# Altium schematic sheet game_console_schematic.SchDoc
size A4; SheetNumber: 1; SheetTotal: 2
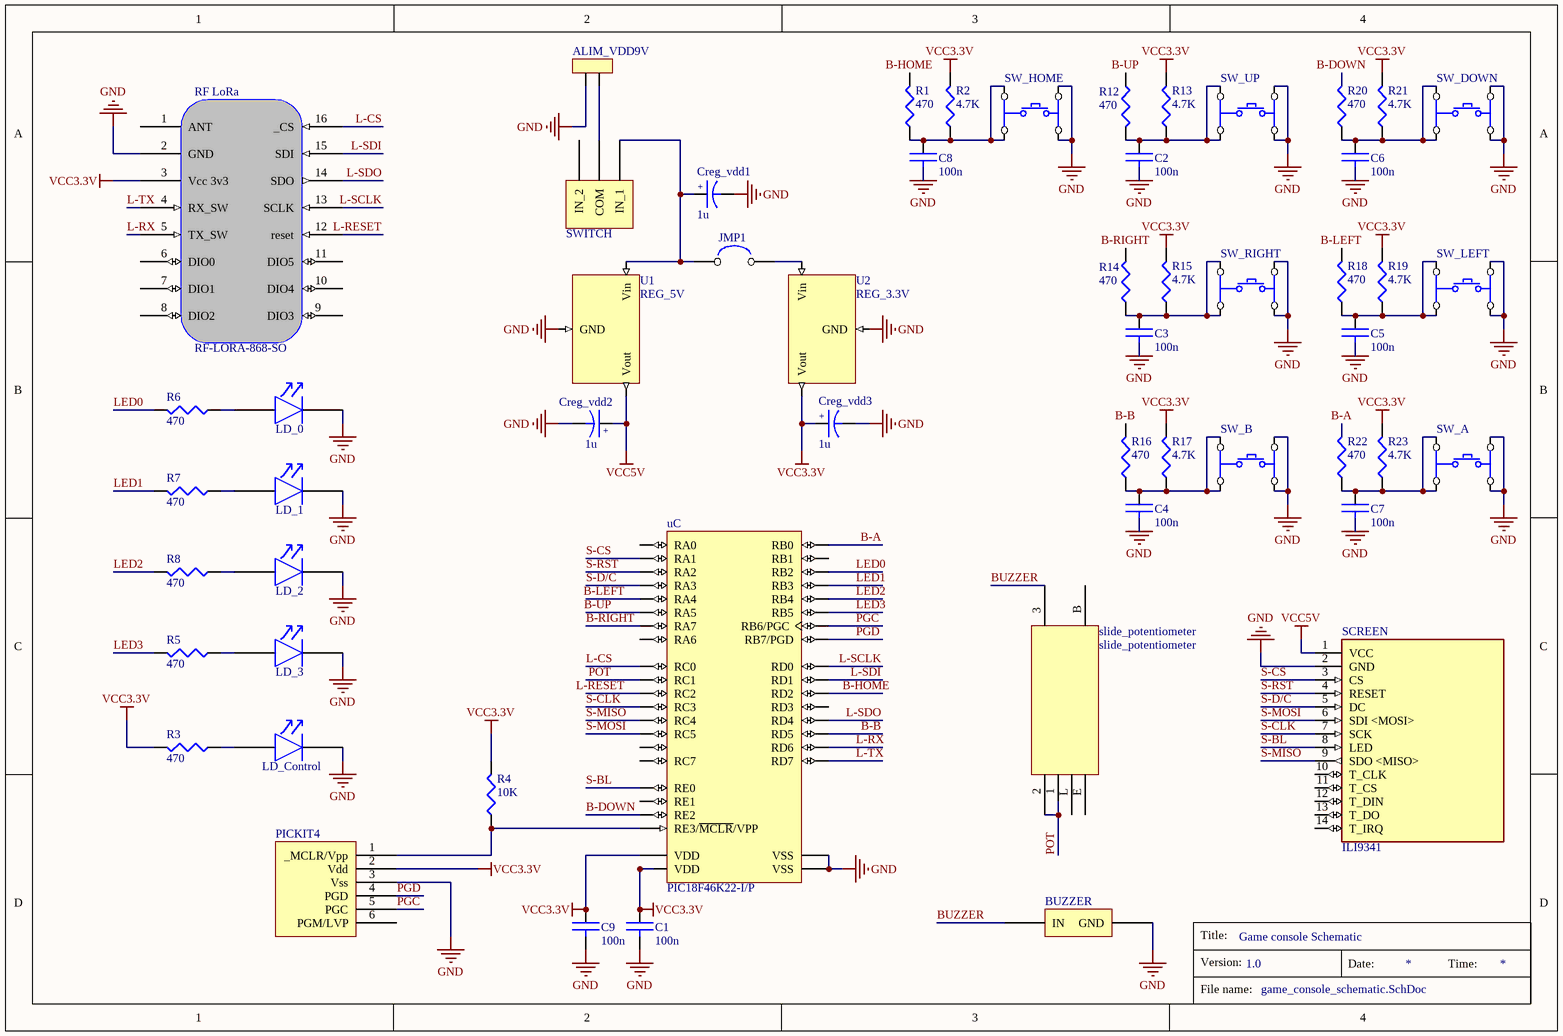
[diagram p0: game_console_schematic.SchDoc]

## Parts
ALIM_VDD9V  ALIM_9V  [AMP_2]  (value not drawn)
BUZZER  BUZZER  [BUZZER]  (value not drawn)
C1  value 100n  [0805]  (hidden comment: CAP)
C2  value 100n  [0805]  (hidden comment: C)
C3  value 100n  [0805]  (hidden comment: C)
C4  value 100n  [0805]  (hidden comment: C)
C5  value 100n  [0805]  (hidden comment: C)
C6  value 100n  [0805]  (hidden comment: C)
C7  value 100n  [0805]  (hidden comment: C)
C8  value 100n  [0805]  (hidden comment: C)
C9  value 100n  [0805]  (hidden comment: CAP)
Creg_vdd1  value 1u  [RB.2/.4]  (hidden comment: CAP_POL)
Creg_vdd2  value 1u  [RB.2/.4]  (hidden comment: CAP_POL)
Creg_vdd3  value 1u  [RB.2/.4]  (hidden comment: CAP_POL)
JMP1  JUMPER  [JMP2-100]  (value not drawn)
LD_0  0  [LED0805]  (value not drawn)
LD_1  1  [LED0805]  (value not drawn)
LD_2  2  [LED0805]  (value not drawn)
LD_3  3  [LED0805]  (value not drawn)
LD_Control  comment  [LED0805]  (value not drawn)
PICKIT4  PIC-ICSP  [PIC-ICSP]  (value not drawn)
R1  value 470  [0805]  (hidden comment: R0)
R2  value 4.7K  [0805]  (hidden comment: RK)
R3  value 470  [0805]  (hidden comment: R0)
R4  value 10K  [0805]  (hidden comment: RES)
R5  value 470  [0805]  (hidden comment: R0)
R6  value 470  [0805]  (hidden comment: R0)
R7  value 470  [0805]  (hidden comment: R0)
R8  value 470  [0805]  (hidden comment: R0)
R12  value 470  [0805]  (hidden comment: R0)
R13  value 4.7K  [0805]  (hidden comment: RK)
R14  value 470  [0805]  (hidden comment: R0)
R15  value 4.7K  [0805]  (hidden comment: RK)
R16  value 470  [0805]  (hidden comment: R0)
R17  value 4.7K  [0805]  (hidden comment: RK)
R18  value 470  [0805]  (hidden comment: R0)
R19  value 4.7K  [0805]  (hidden comment: RK)
R20  value 470  [0805]  (hidden comment: R0)
R21  value 4.7K  [0805]  (hidden comment: RK)
R22  value 470  [0805]  (hidden comment: R0)
R23  value 4.7K  [0805]  (hidden comment: RK)
RF_LoRa  RF-LORA-868-SO  [RF-LORA-868-DIP]
SCREEN  ILI9341  [ILI9341_Display]
slide_potentiometer  slide_potentiometer  [ptl_series_slide_potentiometer]
SW_A  A  [KSA]  (value not drawn)
SW_B  B  [KSA]  (value not drawn)
SW_DOWN  SW_PB  [KSA]  (value not drawn)
SW_HOME  HOME  [KSA]  (value not drawn)
SW_LEFT  SW_PB  [KSA]  (value not drawn)
SW_RIGHT  SW_PB  [KSA]  (value not drawn)
SW_UP  SW_PB  [KSA]  (value not drawn)
SWITCH  SWITCH_SPDT_ON_ON_2  [SW_MFP-161]  (value not drawn)
U1  REG_5V  [TO220H]
U2  REG_3.3V  [TO220H]
uC  PIC18F46K22-I/P  [MCHP-PDIP-P40]

## Nets
GND: ALIM_VDD9V.2 BUZZER.2(GND) C1.2 C2.2 C3.2 C4.2 C5.2 C6.2 C7.2 C8.2 C9.2 Creg_vdd1.2 Creg_vdd2.2 Creg_vdd3.2 LD_0.K LD_1.K LD_2.K LD_3.K LD_Control.K PICKIT4.3(Vss) RF_LoRa.2(GND) SCREEN.2(GND) SW_A.3 SW_A.4 SW_B.3 SW_B.4 SW_DOWN.3 SW_DOWN.4 SW_HOME.3 SW_HOME.4 SW_LEFT.3 SW_LEFT.4 SW_RIGHT.3 SW_RIGHT.4 SW_UP.3 SW_UP.4 U1.2(GND) U2.2(GND) uC.12(VSS) uC.31(VSS)
VCC3.3V: C1.1 C9.1 Creg_vdd3.1 PICKIT4.2(Vdd) R2.2 R3.2 R4.2 R13.2 R15.2 R17.2 R19.2 R21.2 R23.2 RF_LoRa.3(Vcc_3v3) U2.3(Vout) uC.11(VDD) uC.32(VDD)
VCC5V: Creg_vdd2.1 SCREEN.1(VCC) U1.3(Vout)
B-A: R22.2 uC.33(RB0)
B-B: R16.2 uC.28(RD5)
B-DOWN: R20.2 uC.10(RE2)
B-HOME: R1.2 uC.21(RD2)
B-LEFT: R18.2 uC.6(RA4)
B-RIGHT: R14.2 uC.13(RA7)
B-UP: R12.1 uC.7(RA5)
BUZZER: BUZZER.1(IN) slide_potentiometer.3
L-CS: RF_LoRa.16(_CS) uC.15(RC0)
L-RESET: RF_LoRa.12(reset) uC.17(RC2)
L-RX: RF_LoRa.5(TX_SW) uC.29(RD6)
L-SCLK: RF_LoRa.13(SCLK) uC.19(RD0)
L-SDI: RF_LoRa.15(SDI) uC.20(RD1)
L-SDO: RF_LoRa.14(SDO) uC.27(RD4)
L-TX: RF_LoRa.4(RX_SW) uC.30(RD7)
LED0: R6.2 uC.35(RB2)
LED1: R7.2 uC.36(RB3)
LED2: R8.2 uC.37(RB4)
LED3: R5.2 uC.38(RB5)
PGC: PICKIT4.5(PGC) uC.39(RB6/PGC)
PGD: PICKIT4.4(PGD) uC.40(RB7/PGD)
POT: slide_potentiometer.1 slide_potentiometer.2 uC.16(RC1)
S-BL: SCREEN.8(LED) uC.8(RE0)
S-CLK: SCREEN.7(SCK) uC.18(RC3)
S-CS: SCREEN.3(CS) uC.3(RA1)
S-D/C: SCREEN.5(DC) uC.5(RA3)
S-MISO: SCREEN.9(SDO_<MISO>) uC.23(RC4)
S-MOSI: SCREEN.6(SDI_<MOSI>) uC.24(RC5)
S-RST: SCREEN.4(RESET) uC.4(RA2)
NetALIM_VDD9V_1: ALIM_VDD9V.1 SWITCH.2(COM)
NetC2_1: C2.1 R12.2 R13.1 SW_UP.1 SW_UP.2
NetC3_1: C3.1 R14.1 R15.1 SW_RIGHT.1 SW_RIGHT.2
NetC4_1: C4.1 R16.1 R17.1 SW_B.1 SW_B.2
NetC5_1: C5.1 R18.1 R19.1 SW_LEFT.1 SW_LEFT.2
NetC6_1: C6.1 R20.1 R21.1 SW_DOWN.1 SW_DOWN.2
NetC7_1: C7.1 R22.1 R23.1 SW_A.1 SW_A.2
NetC8_1: C8.1 R1.1 R2.1 SW_HOME.1 SW_HOME.2
NetCreg_vdd1_1: Creg_vdd1.1 JMP1.1 SWITCH.1(IN_1) U1.1(Vin)
NetJMP1_2: JMP1.2 U2.1(Vin)
NetLD_0_A: LD_0.A R6.1
NetLD_1_A: LD_1.A R7.1
NetLD_2_A: LD_2.A R8.1
NetLD_3_A: LD_3.A R5.1
NetLD_Control_A: LD_Control.A R3.1
NetPICKIT4_1: PICKIT4.1(_MCLR/Vpp) R4.1 uC.1(RE3/~{MCLR}/VPP)

Not connected (* = marked no-connect by the designer): PICKIT4 6(PGM/LVP); RF_LoRa 1(ANT) 6(DIO0) 7(DIO1) 8(DIO2) 9(DIO3) 10(DIO4) 11(DIO5); SCREEN 10(T_CLK) 11(T_CS) 12(T_DIN) 13(T_DO) 14(T_IRQ); slide_potentiometer B E L; SWITCH 3(IN_2); uC 2(RA0) 9(RE1) 14(RA6) 22(RD3) 25(RC6) 26(RC7) 34(RB1)

## Notes on the sheet
- 1.0
- Game console Schematic
- Title:
- Version:
- Date:
- Time:
- File name:
- (in symbol CAP_POL) +

## Library data of the parts
ALIM_VDD9V = POWER2: connecteur alim 2 pôles
C1-C9 = CAP: capacité non polarisée
Creg_vdd1-Creg_vdd3 = CAP_POL: capacité polarisée
JMP1 = JUMPER2: cavalier 1 position
LD_0-LD_3 LD_Control = LED: LED 5mm/3mm/CMS
R1-R8 R12-R23 = RES: resistance
SCREEN = 2478: Resistive Graphic LCD Display Module Red, Green, Blue (RGB) TFT - Color Parallel, 8-Bit, SPI 2.4 (60.96mm) 240 x 320; MF: Adafruit Industries; Package: NON STANDARD Adafruit; Price: None; Value: *; SnapEDA_Link: https://www.snapeda.com/parts/2478/Adafruit+Industries+LLC/view-part/?ref=snap; MP: 2478; Availability: In Stock; Check_prices: https://www.snapeda.com/parts/2478/Adafruit+Industries+LLC/view-part/?ref=eda
SW_A SW_B SW_HOME = SW_PB
U1 U2 = REG_POS: régulateur positif fixe
uC = PIC18F46K22-I/P: Low-Power, High-Performance Microcontroller with XLP Technology, 64 MHz, 35 I/O, -40 to 85 degC, 40-pin PDIP (P40), Tube; Manufacturer: Microchip; # of A/D Channels: 28; Digital Communication: 2 -A/E/USART, 2 -MSSP(SPI/I2C); EEPROM Data Memory (bytes): 1024; I/O Pins: 35; Internal Oscillator: 16 MHz, 31 kHz; Max. CPU Speed MHz: 64; Memory Type: Flash; Operation Voltage Range: 2.3V - 5.5V; Program Memory KWords: 32; RAM: 3896; Timers: 3 - 8-bit, 4 - 16-bit; DatasheetVersion: Rev. F; PackageVersion: C04-016B, 04/2013; PackageReference: PDIP-P40; PackageDescription: 40-Lead Plastic Dual In-Line Package, Body 51.75 x 13.53 mm, Pitch 2.54 mm; Supplier 1: Digi-Key; Supplier Part Number 1: PIC18F46K22-I/P-ND; Supplier 2: Farnell; Supplier Part Number 2: 1814979; Supplier 3: Newark; Supplier Part Number 3: 65R6012; Supplier 4: Mouser; Supplier Part Number 4: 579-PIC18F46K22IP; Packing: TUBE; Program Memory KBytes: 64; RoHS: TRUE; Mounting Technology: Through Hole; PartNumber: PIC18F46K22-I/P; ComponentLink1Description: Datasheet; ComponentLink1URL: http://ww1.microchip.com/downloads/en/DeviceDoc/41412F.pdf; ComponentLink2Description: Package Specification; ComponentLink2URL: http://www.microchip.com/stellent/groups/techpub_sg/documents/packagingspec/en012702.pdf; ComponentLink3Description: URL Link1; ComponentLink3URL: Product URL:http://www.microchip.com/datasheet/PIC18F46K22